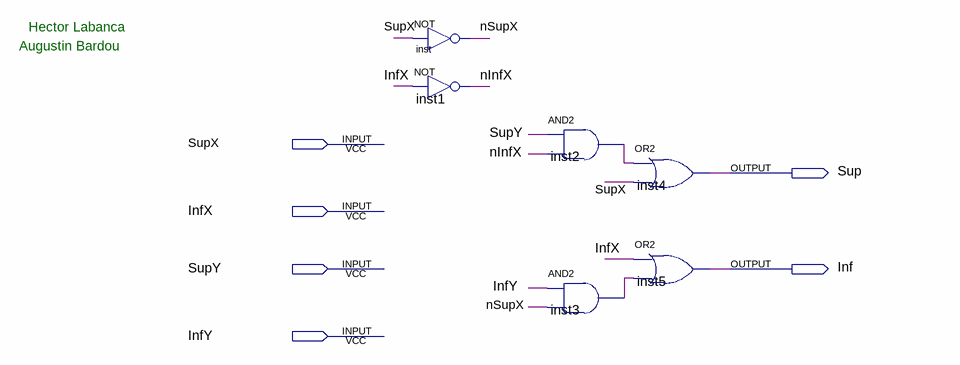
[diagram p0: schematic sheet]
// Quartus schematic EXP2.bdf as structural Verilog: 6 symbols, 6 pins
module EXP2 (
  input  SupX,
  input  InfX,
  input  SupY,
  input  InfY,
  output Sup,
  output Inf
);

  wire inst2_out, inst3_out, nInfX, nSupX;

  not inst (nSupX, SupX);
  not inst1 (nInfX, InfX);
  and inst2 (inst2_out, SupY, nInfX);
  and inst3 (inst3_out, InfY, nSupX);
  or inst4 (Sup, inst2_out, SupX);
  or inst5 (Inf, InfX, inst3_out);

  // Notes on the sheet:
  //   Hector Labanca
  //   Augustin Bardou
endmodule
